# EAGLE schematic v0.0 (EAGLE 5.11)
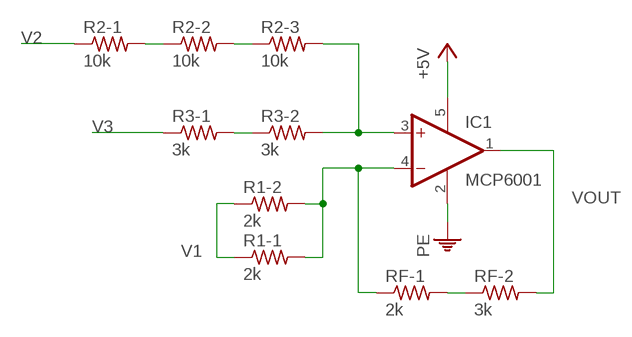
[diagram p0: schematic, sheet 1]

## Parts
IC1  MCP6001  [SOT-23-5L]
R1-1  2k  R-US_R0805  [R0805]
R1-2  2k  R-US_R0805  [R0805]
R2-1  10k  R-US_R0805  [R0805]
R2-2  10k  R-US_R0805  [R0805]
R2-3  10k  R-US_R0805  [R0805]
R3-1  3k  R-US_R0805  [R0805]
R3-2  3k  R-US_R0805  [R0805]
RF-1  2k  R-US_R0805  [R0805]
RF-2  3k  R-US_R0805  [R0805]

## Nets
+5V: IC1.5(V+)
N$1: IC1.3(+IN) R2-3.2 R3-2.2
N$2: RF-1.2 RF-2.1
N$4: R2-1.2 R2-2.1
N$5: R2-2.2 R2-3.1
N$6: R3-1.2 R3-2.1
N$9: IC1.4(-IN) R1-1.2 R1-2.2 RF-1.1
PE: IC1.2(V-)
V1: R1-1.1 R1-2.1
V2: R2-1.1
V3: R3-1.1
VOUT: IC1.1(OUT) RF-2.2

## Library data of the parts
IC1 = Alan Rosenthal:MCP6001
R1-1 R1-2 R2-1-R2-3 R3-1 R3-2 RF-1 RF-2 = rcl:R-US_: RESISTOR, American symbol